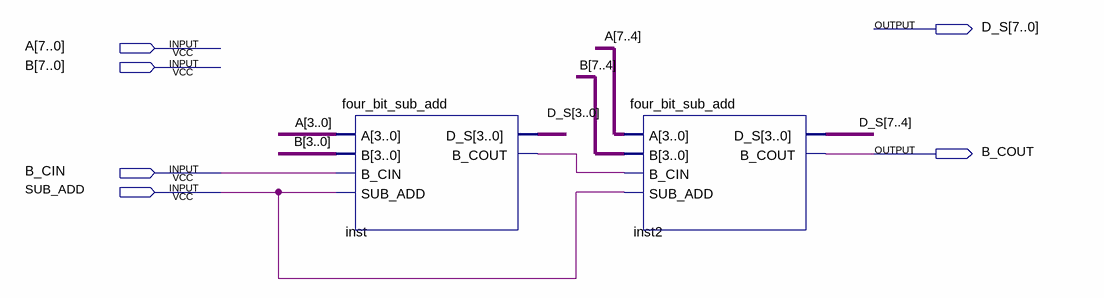
[diagram p0: schematic sheet]
// Quartus schematic eight_bit_sub_add.bdf as structural Verilog: 2 symbols, 6 pins
module eight_bit_sub_add (
  input  [7:0] A,
  input  [7:0] B,
  input  B_CIN,
  input  SUB_ADD,
  output [7:0] D_S,
  output B_COUT
);

  wire inst_b_cout;

  four_bit_sub_add inst (
    .A(A[3:0]), .B(B[3:0]), .B_CIN(B_CIN), .SUB_ADD(SUB_ADD), .D_S(D_S[3:0]), .B_COUT(inst_b_cout));
  four_bit_sub_add inst2 (
    .A(A[7:4]), .B(B[7:4]), .B_CIN(inst_b_cout), .SUB_ADD(SUB_ADD), .D_S(D_S[7:4]), .B_COUT(B_COUT));
endmodule
